# EasyEDA Pro project 6050_Adapter.eprj

# Board PCB1
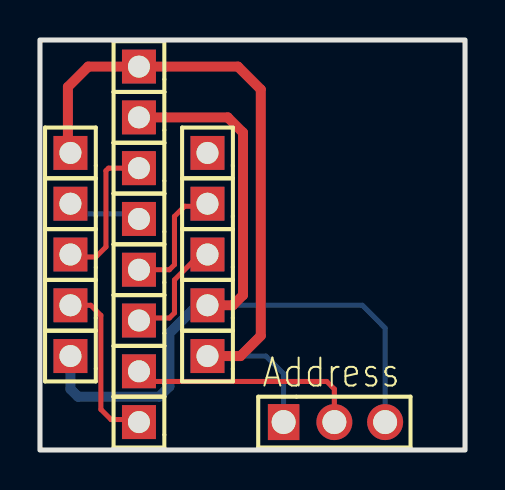
[diagram p0: board, top side]
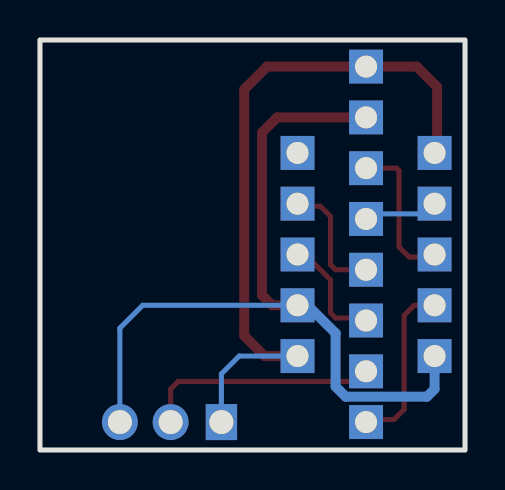
[diagram p1: board, bottom side, seen from below]

Outline 21.27 x 20.51 mm; copper layers: Top Layer, Bottom Layer. Coordinates in mm from the lower left corner of the outline.
Outline path: rectangle 0,20.51 21.27,0
Stack: Top Layer 0.035mm / Dielectric1 1.51mm FR4 er 4.5 / Bottom Layer 0.035mm

## Design rules (mm)
spacing safeClearance (default): track to track 0.152, other pairs 0.152 to 0.3
track width trackWidth (default): min 0.127, default 0.254, max 2.54
differential pair differentialPair (default): width min 0.127, default 0.254, max 2.54; gap min 0.152, default 0.152
via viaSize (default): diameter min 0.5, default 0.61, max 10; hole min 0.3, default 0.305, max 6

## Placement (name value [footprint] x y rotation side)
AD0  -  [HDR-TH_1P-P2.54-V-M]  4.95 3.94 0 top
DRDY  -  [HDR-TH_1P-P2.54-V-M]  8.38 14.86 0 top
ECL  -  [HDR-TH_1P-P2.54-V-M]  4.95 6.48 0 top
EDA  -  [HDR-TH_1P-P2.54-V-M]  4.95 9.02 0 top
GND  -  [HDR-TH_1P-P2.54-V-M]  1.52 4.7 0 top
GND#2  -  [HDR-TH_1P-P2.54-V-M]  4.95 16.64 0 top
GND#3  -  [HDR-TH_1P-P2.54-V-M]  8.38 7.24 0 top
H2  -  [HDR-TH_3P-P2.54-V-M-1]  14.73 1.4 0 top
INT  -  [HDR-TH_1P-P2.54-V-M]  1.52 7.24 0 top
INT#2  -  [HDR-TH_1P-P2.54-V-M]  4.95 1.4 0 top
SCL  -  [HDR-TH_1P-P2.54-V-M]  1.52 9.78 0 top
SCL#2  -  [HDR-TH_1P-P2.54-V-M]  4.95 14.1 0 top
SCL_G  -  [HDR-TH_1P-P2.54-V-M]  8.38 9.78 0 top
SDA  -  [HDR-TH_1P-P2.54-V-M]  1.52 12.32 0 top
SDA#2  -  [HDR-TH_1P-P2.54-V-M]  4.95 11.56 0 top
SDA_G  -  [HDR-TH_1P-P2.54-V-M]  8.38 12.32 0 top
VCC  -  [HDR-TH_1P-P2.54-V-M]  1.52 14.86 0 top
VCC#2  -  [HDR-TH_1P-P2.54-V-M]  4.95 19.18 0 top
VCC#3  -  [HDR-TH_1P-P2.54-V-M]  8.38 4.7 0 top

## Footprints (pads in the part's own frame, mm; a bottom-side part is the same pattern mirrored in y, then rotated)
HDR-TH_1P-P2.54-V-M
  rect 1.7x1.7 hole 1.1: 1(0,0)
HDR-TH_3P-P2.54-V-M-1
  rect 1.575x1.801 hole 1.199: 1(-2.54,0)
  round 1.801 hole 1.199: 2(0,0) 3(2.54,0)

## Nets
$1N1216: INT.1 INT#2.1
$1N1268: SCL.1 SCL#2.1
$1N1307: SDA.1 SDA#2.1
$1N2214: EDA.1 SDA_G.1
$1N2259: ECL.1 SCL_G.1
$1N2843: H2.1 VCC.1 VCC#2.1 VCC#3.1
$1N2847: GND.1 GND#2.1 GND#3.1 H2.3
$1N3789: AD0.1 H2.2

Pads without a net: DRDY 1

## Routing (per net, layer and track width the routed paths; a pad name or vN(x,y) marks a point on that pad's centre or on a via; arc(x,y) is an arc through that point)
$1N1216: length 8.6
  Top Layer w0.254: INT.1 2.54,7.24 3.05,6.73 3.05,2.03 3.56,1.52 4.83,1.52 INT#2.1
$1N1268: length 7.6
  Top Layer w0.254: SCL#2.1 3.43,14.1 3.3,13.97 3.3,10.16 2.79,9.65 1.65,9.65 SCL.1
$1N1307: length 3.7
  Bottom Layer w0.254: SDA#2.1 4.7,11.81 2.03,11.81 SDA.1
$1N2214: length 6.2
  Top Layer w0.254: EDA.1 6.48,9.02 6.73,9.27 6.73,11.68 7.24,12.19 8.25,12.19 SDA_G.1
$1N2259: length 5.8
  Top Layer w0.254: SCL_G.1 8,9.78 6.73,8.51 6.73,6.86 6.48,6.6 5.08,6.6 ECL.1
$1N2843: length 35.9
  Top Layer w0.5: VCC.1 1.4,14.99 1.4,18.16 2.41,19.18 VCC#2.1 9.91,19.18 11.05,18.03 11.05,5.72 10.03,4.7 VCC#3.1
  Bottom Layer w0.254: VCC#3.1 11.3,4.7 12.19,3.81 H2.1
$1N2847: length 41.8
  Top Layer w0.5: GND#3.1 9.65,7.24 10.16,7.75 10.16,15.88 9.4,16.64 GND#2.1
  Bottom Layer w0.254: GND#3.1 16.13,7.24 17.27,6.1 H2.3
  Bottom Layer w0.5: GND.1 1.52,3.05 1.91,2.67 5.97,2.67 6.48,3.17 6.48,5.84 7.87,7.24 GND#3.1
$1N3789: length 11.8
  Top Layer w0.254: AD0.1 5.46,3.43 14.35,3.43 14.73,3.05 H2.2

## Text on the board
Top Silkscreen Layer: Address
